# EAGLE design Sensor LF V.2B (EAGLE 7.2.0)
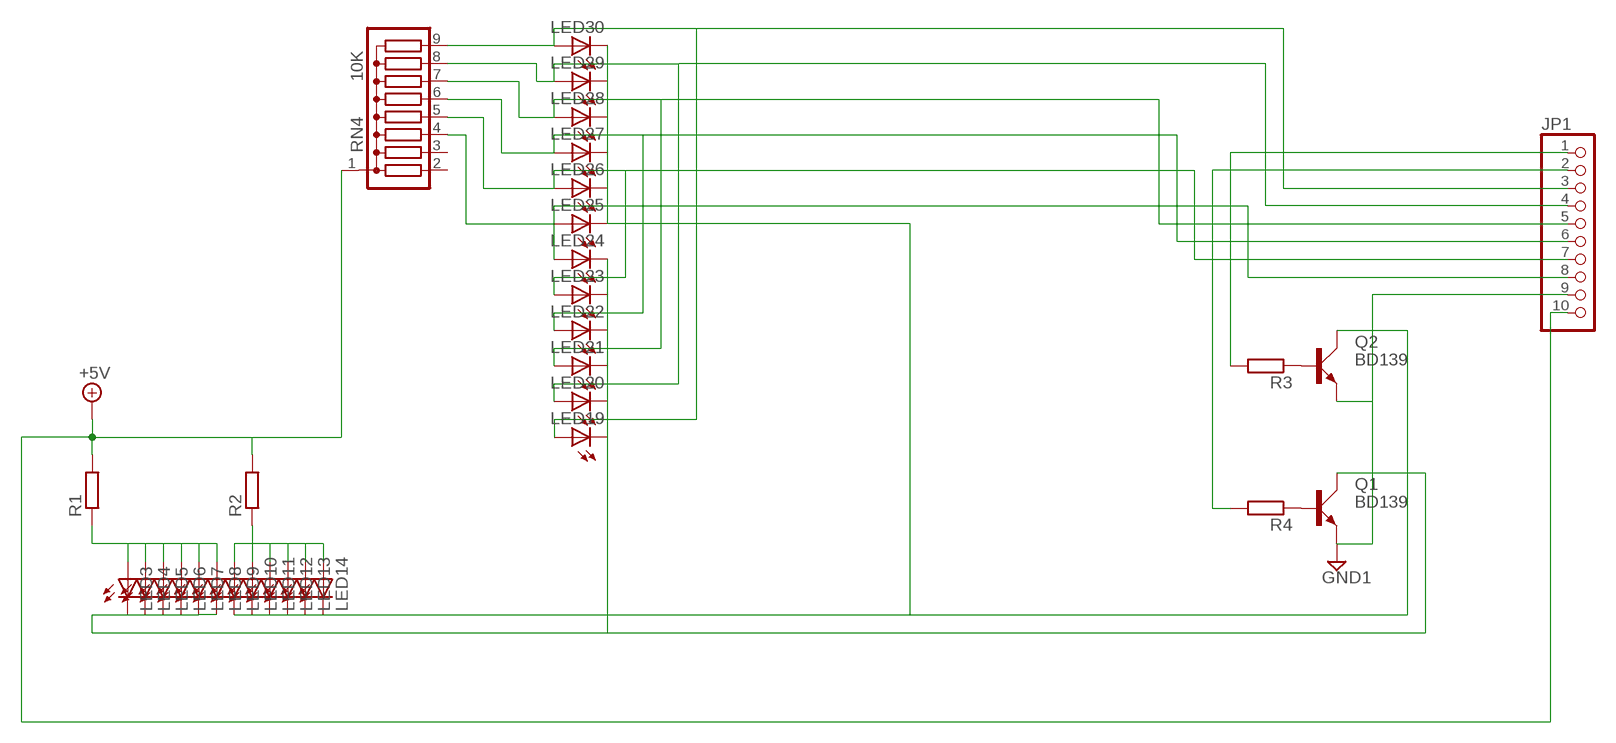
[diagram p0: schematic, sheet 1]

## Parts
JP1  PINHD-1X10  [1X10]
LED3  LED3MM  [LED3MM]
LED4  LED3MM  [LED3MM]
LED5  LED3MM  [LED3MM]
LED6  LED3MM  [LED3MM]
LED7  LED3MM  [LED3MM]
LED8  LED3MM  [LED3MM]
LED9  LED3MM  [LED3MM]
LED10  LED3MM  [LED3MM]
LED11  LED3MM  [LED3MM]
LED12  LED3MM  [LED3MM]
LED13  LED3MM  [LED3MM]
LED14  LED3MM  [LED3MM]
LED19  LED3MM  [LED3MM]
LED20  LED3MM  [LED3MM]
LED21  LED3MM  [LED3MM]
LED22  LED3MM  [LED3MM]
LED23  LED3MM  [LED3MM]
LED24  LED3MM  [LED3MM]
LED25  LED3MM  [LED3MM]
LED26  LED3MM  [LED3MM]
LED27  LED3MM  [LED3MM]
LED28  LED3MM  [LED3MM]
LED29  LED3MM  [LED3MM]
LED30  LED3MM  [LED3MM]
Q1  BD139  [TO126AV]
Q2  BD139  [TO126AV]
R1  R-EU_0207/10  [0207/10]
R2  R-EU_0207/10  [0207/10]
R3  R-EU_0207/10  [0207/10]
R4  R-EU_0207/10  [0207/10]
RN4  10K  G08R  [SIL9]

## Nets
+5V: JP1.10 R1.2 R2.2 RN4.1
GND1: JP1.9 Q1.E Q2.E
N$2: LED9.K(C) LED10.K(C) LED11.K(C) LED12.K(C) LED13.K(C) LED14.K(C) LED25.K(C) LED26.K(C) LED27.K(C) LED28.K(C) LED29.K(C) LED30.K(C) Q2.C
N$3: LED3.K(C) LED4.K(C) LED5.K(C) LED6.K(C) LED7.K(C) LED8.K(C) LED19.K(C) LED20.K(C) LED21.K(C) LED22.K(C) LED23.K(C) LED24.K(C) Q1.C
N$4: Q2.B R3.1
N$5: Q1.B R4.1
N$6: JP1.1 R3.2
N$7: JP1.2 R4.2
N$25: JP1.8 LED24.A LED25.A RN4.4
N$26: JP1.7 LED23.A LED26.A RN4.5
N$27: JP1.6 LED22.A LED27.A RN4.6
N$28: JP1.5 LED21.A LED28.A RN4.7
N$29: JP1.4 LED20.A LED29.A RN4.8
N$30: JP1.3 LED19.A LED30.A RN4.9
N$39: LED3.A LED4.A LED5.A LED6.A LED7.A LED8.A R1.1
N$46: LED9.A LED10.A LED11.A LED12.A LED13.A LED14.A R2.1
Unconnected: RN4.2 RN4.3

## Library data of the parts
JP1 = pinhead:PINHD-1X10: PIN HEADER
LED3-LED14 LED19-LED30 = led:LED: LED OSRAM: - CHIPLED LG R971, LG N971, LY N971, LG Q971, LY Q971, LO R971, LY R971 LH N974, LH R974 LS Q976, LO Q976, LY Q976 LO Q996 - Hyper CHIPLED LW Q18S LB Q993, LB Q99A, LB R99A - SideLED LS A670, LO A670, LY A670, LG A670, LP A670 LB A673, LV A673, LT A673, LW A673 LH A674 LY A675 LS A676, LA A676, LO A676, LY A676, LW A676 LS A679, LY A679, LG A679 - Hyper Micro SIDELED® LS Y876, LA Y876, LO Y876, LY Y876 LT Y87S - SmartLED LW L88C, LW L88S LB L89C, LB L89S, LG L890 LS L89K, LO L89K, LY L89K LS L896, LA L896, LO L896, LY L896 - TOPLED LS T670, LO T670, LY T670, LG T670, LP T670 LSG T670, LSP T670, LSY T670, LOP T670, LYG T670 LG T671, LOG T671, LSG T671 LB T673, LV T673, LT T673, LW T673 LH T674 LS T676, LA T676, LO T676, LY T676, LB T676, LH T676, LSB T676, LW T676 LB T67C, LV T67C, LT T67C, LS T67K, LO T67K, LY T67K, LW E67C LS E67B, LA E67B, LO E67B, LY E67B, LB E67C, LV E67C, LT E67C LW T67C LS T679, LY T679, LG T679 LS T770, LO T770, LY T770, LG T770, LP T770 LB T773, LV T773, LT T773, LW T773 LH T774 LS E675, LA E675, LY E675, LS T675 LS T776, LA T776, LO T776, LY T776, LB T776 LHGB T686 LT T68C, LB T68C - Hyper Mini TOPLED® LB M676 - Mini TOPLED Santana® LG M470 LS M47K, LO M47K, LY M47K Source: http://www.osram.convergy.de LUXEON: - LUMILED® LXK2-PW12-R00, LXK2-PW12-S00, LXK2-PW14-U00, LXK2-PW14-V00 LXK2-PM12-R00, LXK2-PM12-S00, LXK2-PM14-U00 LXK2-PE12-Q00, LXK2-PE12-R00, LXK2-PE12-S00, LXK2-PE14-T00, LXK2-PE14-U00 LXK2-PB12-K00, LXK2-PB12-L00, LXK2-PB12-M00, LXK2-PB14-N00, LXK2-PB14-P00, LXK2-PB14-Q00 LXK2-PR12-L00, LXK2-PR12-M00, LXK2-PR14-Q00, LXK2-PR14-R00 LXK2-PD12-Q00, LXK2-PD12-R00, LXK2-PD12-S00 LXK2-PH12-R00, LXK2-PH12-S00 LXK2-PL12-P00, LXK2-PL12-Q00, LXK2-PL12-R00 Source: www.luxeon.com KINGBRIGHT: KA-3528ASYC Source: www.kingbright.com
Q1 Q2 = transistor-power:BD139: NPN TRANSISTOR
R1-R4 = resistor:R-EU_: RESISTOR, European symbol
RN4 = resistor-sil:G08R: SIL RESISTOR

## Net classes
0 default: width 0.051 mm, clearance 0.051 mm

## Board
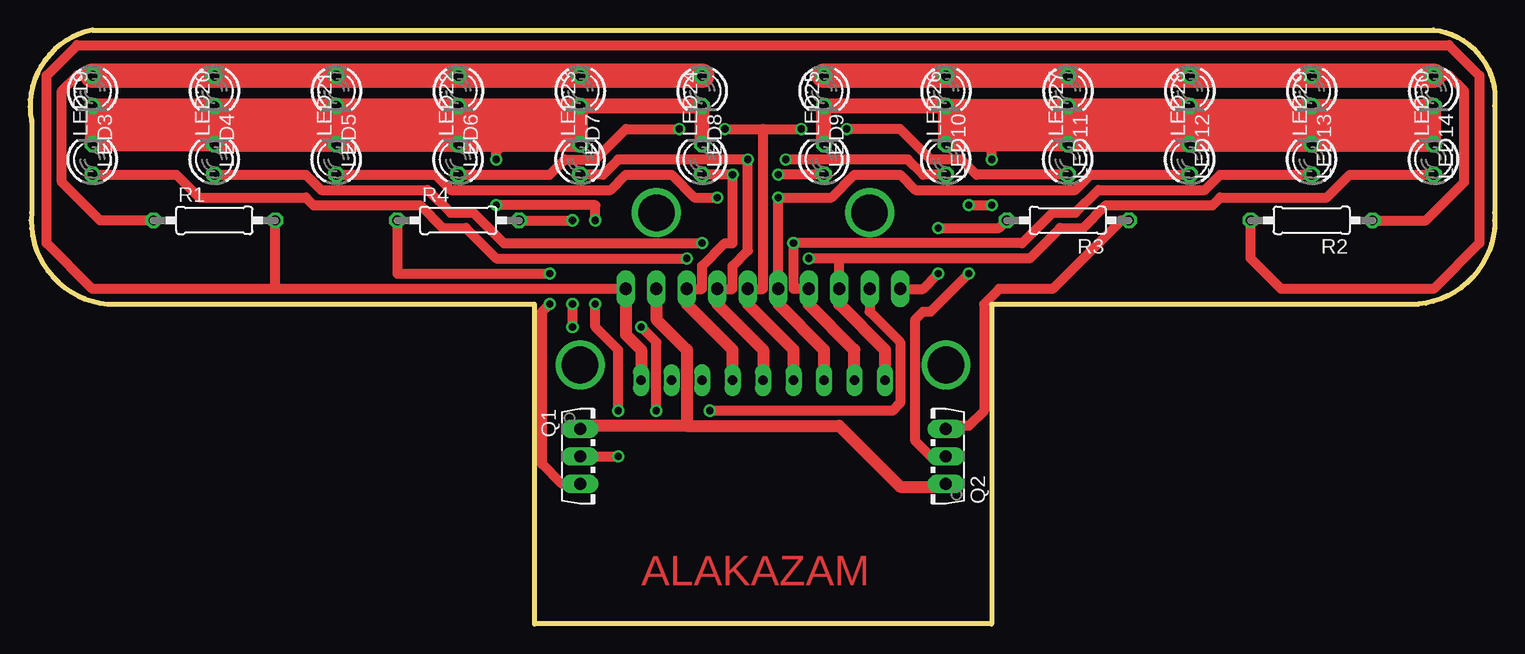
[diagram p1: board, top side]
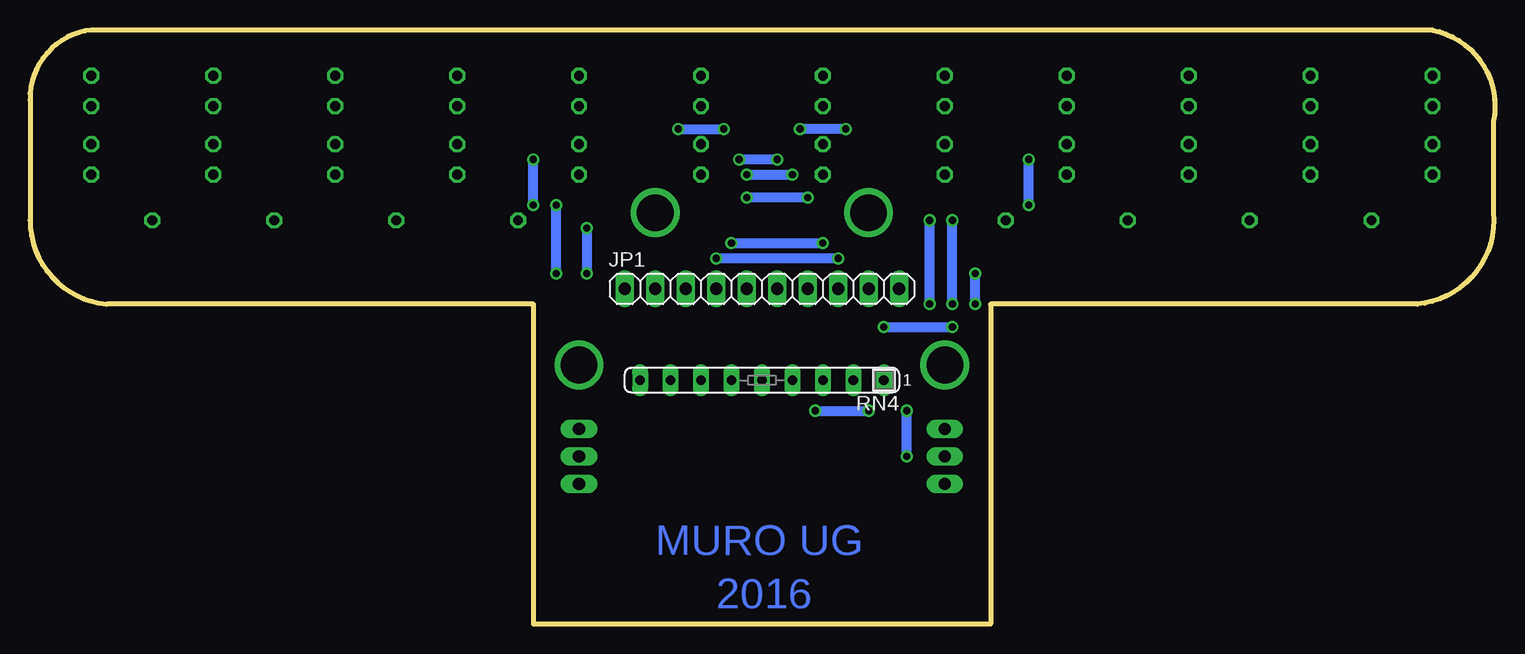
[diagram p2: board, bottom side, seen from below]

Size 122.08 x 49.53 mm. Coordinates in mm from the lower left corner, seen from the top.
Outline: 122.05,34.29 arc-90 115.7,26.67 80.14,26.67 80.14,0 42.04,0 42.04,26.67 6.48,26.67 arc-90 0.13,34.29 0.13,41.91 arc-90 5.21,49.53 116.97,49.53 arc-90 122.05,43.18 122.05,33.66
Copper layers (1*16): Top 0.035mm / dielectric 1.5mm / Bottom 0.035mm
Design rules "default": minimum track width 10mil, minimum drill 24mil, track to track 8mil, track to pad 8mil, pad to pad 8mil, via to via 8mil, smd to smd 8mil, copper to edge 40mil, drill to drill 8mil, minimum pad ring 10mil, minimum via ring 8mil, stop-mask expansion 4mil, vias tented up to drill 0mil, thermal gap 10mil

### Footprints (pad centres in the part's own frame; a part is rotated, then mirrored left to right if it is on the bottom)
1X10 = drill 1.016 long: 1 -11.43,0; 2 -8.89,0; 3 -6.35,0; 4 -3.81,0; 5 -1.27,0; 6 1.27,0; 7 3.81,0; 8 6.35,0; 9 8.89,0; 10 11.43,0
LED3MM = drill 0.813 octagon: A -1.27,0; K 1.27,0
TO126AV = drill 1.016 long: B 2.286,-1.27; C 0,-1.27; E -2.286,-1.27
0207/10 = drill 0.813 octagon: 1 -5.08,0; 2 5.08,0
SIL9 = drill 0.813 long: 1 -10.16,0; 2 -7.62,0; 3 -5.08,0; 4 -2.54,0; 5 0,0; 6 2.54,0; 7 5.08,0; 8 7.62,0; 9 10.16,0

### Placement (x,y rotation side)
JP1  61.09,27.94 0 bottom
LED3  5.21,44.45 270 top
LED4  15.37,44.45 270 top
LED5  25.53,44.45 270 top
LED6  35.69,44.45 270 top
LED7  45.85,44.45 270 top
LED8  56.01,44.45 270 top
LED9  66.17,44.45 270 top
LED10  76.33,44.45 270 top
LED11  86.49,44.45 270 top
LED12  96.65,44.45 270 top
LED13  106.81,44.45 270 top
LED14  116.97,44.45 270 top
LED19  5.21,38.73 90 top
LED20  15.37,38.73 90 top
LED21  25.53,38.73 90 top
LED22  35.69,38.73 90 top
LED23  45.85,38.73 90 top
LED24  56.01,38.73 90 top
LED25  66.17,38.73 90 top
LED26  76.33,38.73 90 top
LED27  86.49,38.73 90 top
LED28  96.65,38.73 90 top
LED29  106.81,38.73 90 top
LED30  116.97,38.73 90 top
Q1  47.12,13.97 270 top
Q2  75.06,13.97 90 top
R1  15.37,33.66 0 top
R2  106.81,33.66 180 top
R3  86.49,33.66 180 top
R4  35.69,33.66 0 top
RN4  61.09,20.32 180 bottom

### Tracks (layer width: path | path; a pad name or v marks a point on that pad's centre or on a via)
+5V
  Top 0.813: JP1.10 20.45,27.94 | 20.45,27.94 5.21,27.94 1.4,31.75 1.4,45.72 3.94,48.26 118.24,48.26 120.78,45.72 120.78,31.75 116.97,27.94 104.27,27.94 101.73,30.48 R2.2 | 20.45,27.94 R1.2
  Top 1.016: JP1.10 49.66,24.13 50.93,22.86 RN4.1
GND1
  Top 1.016: 54.74,16.51 45.85,16.51 Q1.E | JP1.9 52.2,25.4 54.74,22.86 54.74,16.51 | 54.74,16.51 67.44,16.51 72.52,11.43 76.07,11.43 Q2.E
N$2  (via drill 0.6)
  Top 0.813: Q2.C 75.06,13.97 73.79,15.24 73.79,25.4 74.42,26.03 75.06,26.03 v78.23,29.21 | v78.23,34.92 v80.14,34.92 | v80.14,38.73 80.14,40
  Top 1.27: LED25.K LED9.K LED10.K | LED10.K LED26.K 80.14,40 LED27.K | LED10.K LED11.K | LED11.K LED27.K | LED27.K LED28.K LED29.K LED30.K LED14.K LED13.K LED12.K LED11.K
  Bottom 0.813: v78.23,29.21 v78.23,34.92 | v80.14,34.92 v80.14,38.73
N$3  (via drill 0.6)
  Top 0.813: Q1.C v49.02,13.97 | v49.02,17.78 49.02,22.86 47.12,24.77 v47.12,26.67 | v47.12,33.66 47.12,34.92 v38.86,34.92 | v38.86,38.73 38.86,39.37 39.5,40
  Top 1.27: LED24.K LED8.K LED7.K | LED7.K LED23.K 39.5,40 LED22.K | LED7.K LED6.K | LED6.K LED22.K | LED6.K LED5.K | LED5.K LED21.K | LED5.K LED4.K LED3.K LED19.K LED20.K LED22.K
  Bottom 0.813: v49.02,13.97 v49.02,17.78 | v47.12,26.67 v47.12,33.66 | v38.86,34.92 v38.86,38.73
N$4
  Top 0.813: R3.1 90.93,33.66 85.22,27.94 80.77,27.94 79.5,26.67 79.5,17.78 78.23,16.51 76.58,16.51 Q2.B
N$5  (via drill 0.6)
  Top 0.813: R4.1 30.61,29.21 v43.31,29.21 | Q1.B 44.32,11.68 42.67,13.34 42.67,26.03 v43.31,26.67
  Bottom 0.813: v43.31,26.67 v43.31,29.21
N$6  (via drill 0.6)
  Top 0.813: JP1.1 74.42,27.94 v75.69,29.21 | v75.69,33.02 80.77,33.02 R3.2
  Bottom 0.813: v75.69,33.02 v75.69,29.21
N$7  (via drill 0.6)
  Top 0.813: JP1.2 69.98,26.03 72.52,23.49 72.52,18.41 71.88,17.78 v56.64,17.78 | R4.2 v45.21,33.66 | v52.2,17.78 52.2,23.49 v50.93,24.77 | v45.21,24.77 v45.21,26.67
  Bottom 0.813: v56.64,17.78 v52.2,17.78 | v50.93,24.77 v45.21,24.77 | v45.21,26.67 v45.21,33.66
N$25  (via drill 0.6)
  Top 0.813: JP1.8 56.01,27.94 56.01,29.84 57.91,31.75 58.55,31.75 v58.55,37.47 LED24.A | LED25.A v62.36,37.47
  Top 1.016: RN4.4 58.55,22.86 54.74,26.67 JP1.8
  Bottom 0.813: v62.36,37.47 v58.55,37.47
N$26  (via drill 0.6)
  Top 0.813: LED26.A 74.42,37.47 73.15,38.73 v62.99,38.73 | LED23.A 47.75,37.47 49.02,38.73 v59.82,38.73 59.82,31.11 58.55,29.84 58.55,27.94 JP1.7
  Top 1.016: JP1.7 57.28,26.67 61.09,22.86 RN4.5
  Bottom 0.813: v59.82,38.73 v62.99,38.73
N$27  (via drill 0.6)
  Top 0.813: LED27.A 78.87,37.47 77.6,38.73 75.06,38.73 72.52,41.27 v68.07,41.27 | LED22.A 43.31,37.47 44.58,38.73 47.12,38.73 49.66,41.27 v54.1,41.27 | v57.91,41.27 61.09,41.27 | 61.09,41.27 v64.26,41.27 | JP1.6 61.09,27.94 61.09,41.27
  Top 1.016: RN4.6 63.63,22.86 59.82,26.67 JP1.6
  Bottom 0.813: v54.1,41.27 v57.91,41.27 | v68.07,41.27 v64.26,41.27
N$28  (via drill 0.6)
  Top 0.813: LED21.A 33.78,37.47 35.05,36.19 48.39,36.19 49.66,37.47 53.47,37.47 55.37,35.56 v57.28,35.56 | LED28.A 88.39,37.47 87.12,36.19 73.79,36.19 72.52,37.47 68.71,37.47 66.8,35.56 v62.36,35.56 JP1.5
  Top 1.016: JP1.5 62.36,26.67 66.17,22.86 RN4.7
  Bottom 0.813: v57.28,35.56 v62.36,35.56
N$29  (via drill 0.6)
  Top 0.813: LED20.A 22.99,37.47 24.26,36.19 33.15,36.19 35.05,34.29 36.96,34.29 39.5,31.75 v56.01,31.75 | LED29.A 99.19,37.47 97.92,36.19 89.03,36.19 87.12,34.29 85.22,34.29 82.68,31.75 v63.63,31.75 63.63,27.94 JP1.4
  Top 1.016: RN4.8 68.71,22.86 64.9,26.67 JP1.4
  Bottom 0.813: v63.63,31.75 v56.01,31.75
N$30  (via drill 0.6)
  Top 0.813: LED19.A 12.19,37.47 14.1,35.56 22.99,35.56 23.62,34.92 32.51,34.92 34.42,33.02 36.32,33.02 38.86,30.48 v54.74,30.48 | LED30.A 109.98,37.47 108.08,35.56 99.19,35.56 98.55,34.92 89.66,34.92 87.76,33.02 85.85,33.02 83.31,30.48 67.44,30.48 | 67.44,30.48 v64.9,30.48 | JP1.3 67.44,30.48
  Top 1.016: JP1.3 67.44,26.67 71.25,22.86 RN4.9
  Bottom 0.813: v54.74,30.48 v64.9,30.48
N$39
  Top 0.813: R1.1 5.84,33.66 2.67,36.83 2.67,44.45 3.94,45.72 LED3.A
  Top 2.032: LED3.A LED4.A LED5.A LED6.A LED7.A LED8.A
N$46
  Top 0.813: R2.1 116.33,33.66 119.51,36.83 119.51,44.45 118.24,45.72 LED14.A
  Top 2.032: LED14.A LED13.A LED12.A LED11.A LED10.A LED9.A
N$91  (via drill 3.05)
  other vias: 45.85,21.59
N$92  (via drill 3.05)
  other vias: 76.33,21.59
N$93  (via drill 3.05)
  other vias: 52.2,34.29
N$94  (via drill 3.05)
  other vias: 69.98,34.29
(copper drawn outside any net)
  shapes: Top area x2

### Text on the board
Top: ALAKAZAM
Bottom: MURO UG | 2016